# EAGLE design FAL65816_cpu (EAGLE 7.2.0)
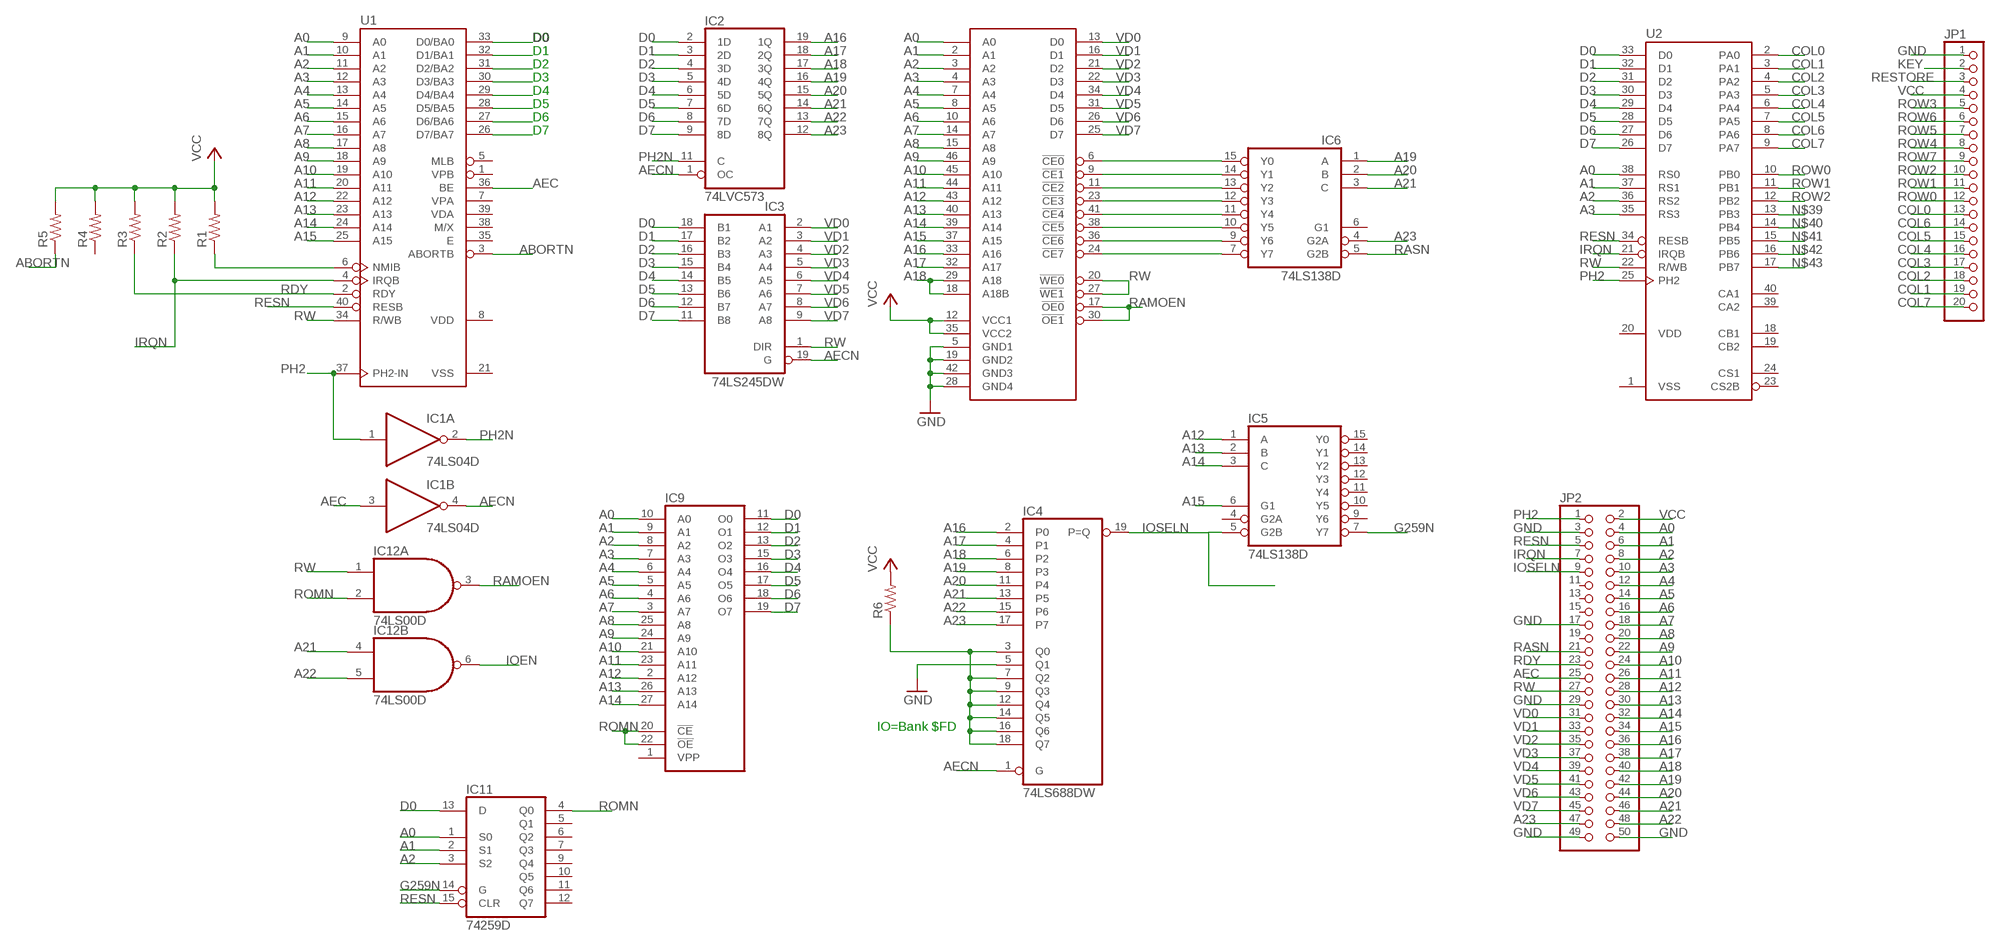
[diagram p0: schematic, sheet 1]

## Parts
IC1  74LS04D  [SO14]
IC2  74LVC573  [SO20W]
IC3  74LS245DW  [SO20W]
IC4  74LS688DW  [SO20W]
IC5  74LS138D  [SO16]
IC6  74LS138D  [SO16]
IC9  27256  [DIL28]
IC11  74259D  [SO16]
IC12  74LS00D  [SO14]
JP1  PINHD-1X20  [1X20]
JP2  PINHD-2X25  [2X25]
R1  R-US_0207/10  [0207/10]
R2  R-US_0207/10  [0207/10]
R3  R-US_0207/10  [0207/10]
R4  R-US_0207/10  [0207/10]
R5  R-US_0207/10  [0207/10]
R6  R-US_0204/7  [0204/7]
U1  W65C816SP  [DIP-40]
U2  G65SC22P  [DIP-40]
U$2  WM-1RAM  [DIL46-1]

## Nets
A0: IC9.10(A0) IC11.1(S0) JP2.4 U1.9(A0) U2.38(RS0) U$2.1(A0)
A1: IC9.9(A1) IC11.2(S1) JP2.6 U1.10(A1) U2.37(RS1) U$2.2(A1)
A2: IC9.8(A2) IC11.3(S2) JP2.8 U1.11(A2) U2.36(RS2) U$2.3(A2)
A3: IC9.7(A3) JP2.10 U1.12(A3) U2.35(RS3) U$2.4(A3)
A4: IC9.6(A4) JP2.12 U1.13(A4) U$2.7(A4)
A5: IC9.5(A5) JP2.14 U1.14(A5) U$2.8(A5)
A6: IC9.4(A6) JP2.16 U1.15(A6) U$2.10(A6)
A7: IC9.3(A7) JP2.18 U1.16(A7) U$2.14(A7)
A8: IC9.25(A8) JP2.20 U1.17(A8) U$2.15(A8)
A9: IC9.24(A9) JP2.22 U1.18(A9) U$2.46(A9)
A10: IC9.21(A10) JP2.24 U1.19(A10) U$2.45(A10)
A11: IC9.23(A11) JP2.26 U1.20(A11) U$2.44(A11)
A12: IC5.1(A) IC9.2(A12) JP2.28 U1.22(A12) U$2.43(A12)
A13: IC5.2(B) IC9.26(A13) JP2.30 U1.23(A13) U$2.40(A13)
A14: IC5.3(C) IC9.27(A14) JP2.32 U1.24(A14) U$2.39(A14)
A15: IC5.6(G1) JP2.34 U1.25(A15) U$2.37(A15)
A16: IC2.19(1Q) IC4.2(P0) JP2.36 U$2.33(A16)
A17: IC2.18(2Q) IC4.4(P1) JP2.38 U$2.32(A17)
A18: IC2.17(3Q) IC4.6(P2) JP2.40 U$2.18(A18B) U$2.29(A18)
A19: IC2.16(4Q) IC4.8(P3) IC6.1(A) JP2.42
A20: IC2.15(5Q) IC4.11(P4) IC6.2(B) JP2.44
A21: IC2.14(6Q) IC4.13(P5) IC6.3(C) IC12.4(B:I0) JP2.46
A22: IC2.13(7Q) IC4.15(P6) IC12.5(B:I1) JP2.48
A23: IC2.12(8Q) IC4.17(P7) IC6.4(G2A) JP2.47
ABORTN: R5.1 U1.3(ABORTB)
AEC: IC1.3(B:I) JP2.25 U1.36(BE)
AECN: IC1.4(B:O) IC2.1(OC) IC3.19(G) IC4.1(G)
COL0: JP1.13 U2.2(PA0)
COL1: JP1.19 U2.3(PA1)
COL2: JP1.18 U2.4(PA2)
COL3: JP1.17 U2.5(PA3)
COL4: JP1.16 U2.6(PA4)
COL5: JP1.15 U2.7(PA5)
COL6: JP1.14 U2.8(PA6)
COL7: JP1.20 U2.9(PA7)
D0: IC2.2(1D) IC3.18(B1) IC9.11(O0) IC11.13(D) U1.33(D0/BA0) U2.33(D0)
D1: IC2.3(2D) IC3.17(B2) IC9.12(O1) U1.32(D1/BA1) U2.32(D1)
D2: IC2.4(3D) IC3.16(B3) IC9.13(O2) U1.31(D2/BA2) U2.31(D2)
D3: IC2.5(4D) IC3.15(B4) IC9.15(O3) U1.30(D3/BA3) U2.30(D3)
D4: IC2.6(5D) IC3.14(B5) IC9.16(O4) U1.29(D4/BA4) U2.29(D4)
D5: IC2.7(6D) IC3.13(B6) IC9.17(O5) U1.28(D5/BA5) U2.28(D5)
D6: IC2.8(7D) IC3.12(B7) IC9.18(O6) U1.27(D6/BA6) U2.27(D6)
D7: IC2.9(8D) IC3.11(B8) IC9.19(O7) U1.26(D7/BA7) U2.26(D7)
G259N: IC5.7(Y7) IC11.14(G)
GND: IC4.5(Q1) JP1.1 JP2.3 JP2.17 JP2.29 JP2.49 JP2.50 U$2.5(GND1) U$2.19(GND2) U$2.28(GND4) U$2.42(GND3)
IOEN: IC12.6(B:O)
IOSELN: IC4.19(P=Q) IC5.5(G2B) JP2.9
IRQN: JP2.7 R2.1 U1.4(IRQB) U2.21(IRQB)
KEY: JP1.2
N$1: R1.1 U1.6(NMIB)
N$4: IC6.15(Y0) U$2.6(!CE0)
N$5: IC6.14(Y1) U$2.9(!CE1)
N$6: IC6.13(Y2) U$2.11(!CE2)
N$7: IC6.12(Y3) U$2.23(!CE3)
N$8: IC6.11(Y4) U$2.41(!CE4)
N$9: IC6.10(Y5) U$2.38(!CE5)
N$10: IC6.9(Y6) U$2.36(!CE6)
N$11: IC6.7(Y7) U$2.24(!CE7)
N$12: IC4.3(Q0) IC4.7(Q2) IC4.9(Q3) IC4.12(Q4) IC4.14(Q5) IC4.16(Q6) IC4.18(Q7) R6.1
N$39: U2.13(PB3)
N$40: U2.14(PB4)
N$41: U2.15(PB5)
N$42: U2.16(PB6)
N$43: U2.17(PB7)
PH2: IC1.1(A:I) JP2.1 U1.37(PH2-IN) U2.25(PH2)
PH2N: IC1.2(A:O) IC2.11(C)
RAMOEN: IC12.3(A:O) U$2.17(!OE0) U$2.30(!OE1)
RASN: IC6.5(G2B) JP2.21
RDY: JP2.23 R3.1 U1.2(RDY)
RESN: IC11.15(CLR) JP2.5 U1.40(RESB) U2.34(RESB)
RESTORE: JP1.3
ROMN: IC9.20(!CE) IC9.22(!OE) IC11.4(Q0) IC12.2(A:I1)
ROW0: JP1.12 U2.10(PB0)
ROW1: JP1.11 U2.11(PB1)
ROW2: JP1.10 U2.12(PB2)
ROW3: JP1.5
ROW4: JP1.8
ROW5: JP1.7
ROW6: JP1.6
ROW7: JP1.9
RW: IC3.1(DIR) IC12.1(A:I0) JP2.27 U1.34(R/WB) U2.22(R/WB) U$2.20(!WE0) U$2.27(!WE1)
VCC: JP1.4 JP2.2 R1.2 R2.2 R3.2 R4.2 R5.2 R6.2 U$2.12(VCC1) U$2.35(VCC2)
VD0: IC3.2(A1) JP2.31 U$2.13(D0)
VD1: IC3.3(A2) JP2.33 U$2.16(D1)
VD2: IC3.4(A3) JP2.35 U$2.21(D2)
VD3: IC3.5(A4) JP2.37 U$2.22(D3)
VD4: IC3.6(A5) JP2.39 U$2.34(D4)
VD5: IC3.7(A6) JP2.41 U$2.31(D5)
VD6: IC3.8(A7) JP2.43 U$2.26(D6)
VD7: IC3.9(A8) JP2.45 U$2.25(D7)
Unconnected: IC1.5(C:I) IC1.6(C:O) IC1.8(D:O) IC1.9(D:I) IC1.10(E:O) IC1.11(E:I) IC1.12(F:O) IC1.13(F:I) IC5.4(G2A) IC5.9(Y6) IC5.10(Y5) IC5.11(Y4) IC5.12(Y3) IC5.13(Y2) IC5.14(Y1) IC5.15(Y0) IC6.6(G1) IC9.1(VPP) IC11.5(Q1) IC11.6(Q2) IC11.7(Q3) IC11.9(Q4) IC11.10(Q5) IC11.11(Q6) IC11.12(Q7) IC12.8(C:O) IC12.9(C:I0) IC12.10(C:I1) IC12.11(D:O) IC12.12(D:I0) IC12.13(D:I1) JP2.11 JP2.13 JP2.15 JP2.19 R4.1 U1.1(VPB) U1.5(MLB) U1.7(VPA) U1.21(VSS) U1.35(E) U1.38(M/X) U1.39(VDA) U2.1(VSS) U2.18(CB1) U2.19(CB2) U2.23(CS2B) U2.24(CS1) U2.39(CA2) U2.40(CA1)

## Notes on the sheet
- IO=Bank $FD

## Power pins joined to a net without a drawn wire
GND: IC1.7(P:GND) IC2.10(GND) IC3.10(GND) IC4.10(GND) IC5.8(GND) IC6.8(GND) IC9.14(GND) IC11.8(GND) IC12.7(P:GND)
VCC: IC1.14(P:VCC) IC2.20(VCC) IC3.20(VCC) IC4.20(VCC) IC5.16(VCC) IC6.16(VCC) IC9.28(VCC) IC11.16(VCC) IC12.14(P:VCC)
VDD: U1.8(VDD) U2.20(VDD)

## Library data of the parts
IC1 = 74xx-us:74*04: Hex INVERTER
IC2 = FT74xx:74*573: 8-bit D latch BUS DRIVER
IC3 = FT74xx:74*245: Octal BUS TRANSCEIVER, 3-state
IC4 = FT74xx:74*688: 8-bit MAGNITUDE/IDENTITY COMPARATOR, totem pole
IC5 IC6 = FT74xx:74*138: 3-line to 8-line DECODER/DEMULTIPLEXER
IC9 = memory:27256: MEMORY
IC11 = 74xx-us:74*259: 8-bit addressable LATCH
IC12 = 74xx-us:74*00: Quad 2-input NAND gate
JP1 = pinhead:PINHD-1X20: PIN HEADER
JP2 = pinhead:PINHD-2X25: PIN HEADER
R1-R6 = resistor:R-US_: RESISTOR, American symbol
U1 = 65xxx:W65C816SP: Wetern Digital Version
U2 = 65xxx:G65SC22P: California Micro Devices Version
U$2 = FT74xx:WM-1RAM: Wilson Mines RAM Module

## Board
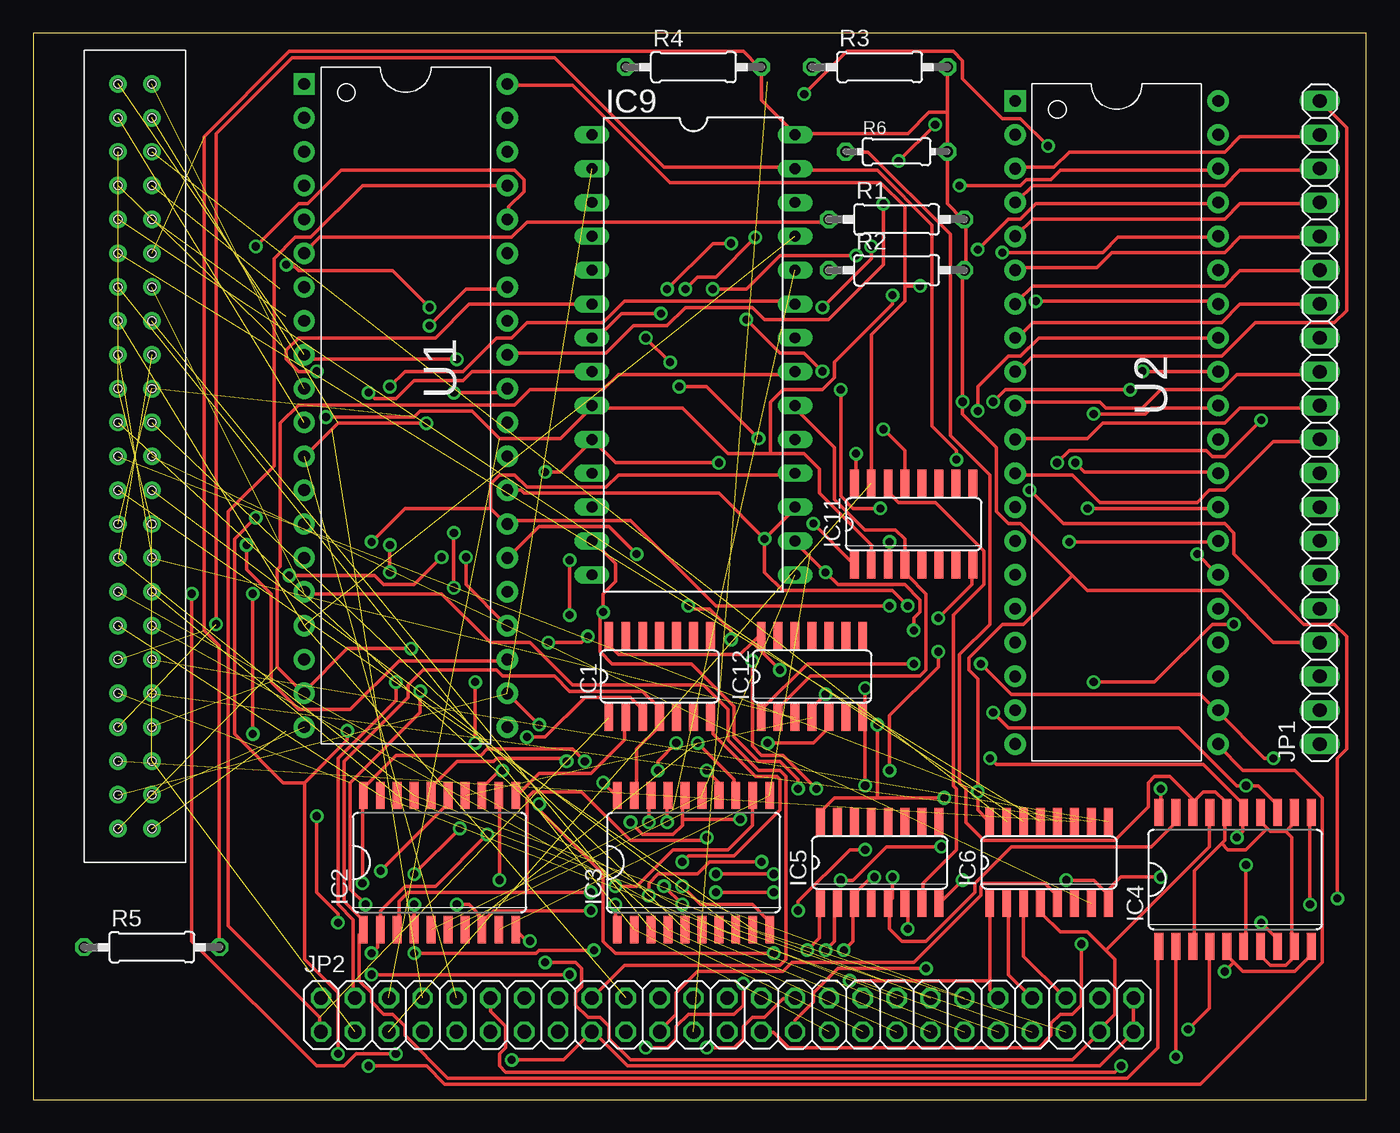
[diagram p1: board, top side]
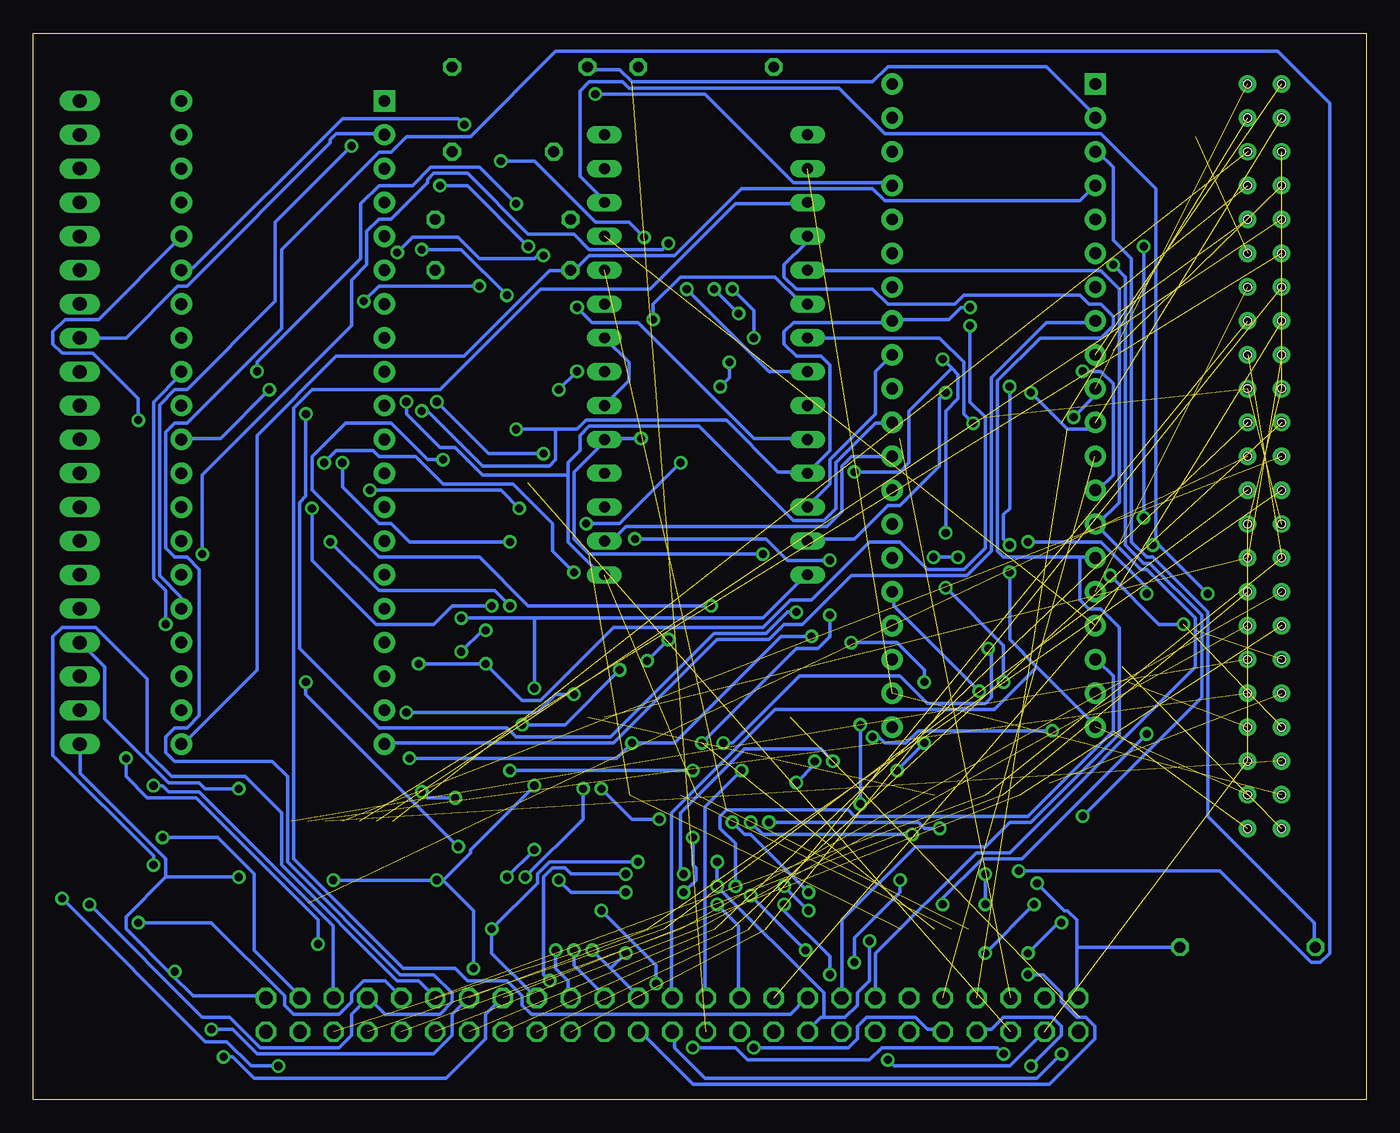
[diagram p2: board, bottom side, seen from below]

Size 100 x 80 mm. Coordinates in mm from the lower left corner, seen from the top.
Outline: 0,0 100,0 100,80 0,80 0,0
Copper layers (1*16): Top 0.035mm / dielectric 1.5mm / Bottom 0.035mm
Design rules "default": minimum track width 10mil, minimum drill 24mil, track to track 8mil, track to pad 8mil, pad to pad 8mil, via to via 8mil, smd to smd 8mil, copper to edge 40mil, drill to drill 8mil, minimum pad ring 10mil, minimum via ring 8mil, stop-mask expansion 4mil, vias tented up to drill 0mil, thermal gap 10mil

### Footprints (pad centres in the part's own frame; a part is rotated, then mirrored left to right if it is on the bottom)
SO14 = smd 0.66 x 2.032: 1 -3.81,-3.073; 2 -2.54,-3.073; 3 -1.27,-3.073; 4 0,-3.073; 5 1.27,-3.073; 6 2.54,-3.073; 7 3.81,-3.073; 8 3.81,3.073; 9 2.54,3.073; 10 1.27,3.073; 11 0,3.073; 12 -1.27,3.073; 13 -2.54,3.073; 14 -3.81,3.073
SO20W = smd 0.66 x 2.032: 1 -5.715,-5.029; 2 -4.445,-5.029; 3 -3.175,-5.029; 4 -1.905,-5.029; 5 -0.635,-5.029; 6 0.635,-5.029; 7 1.905,-5.029; 8 3.175,-5.029; 9 4.445,-5.029; 10 5.715,-5.029; 11 5.715,5.029; 12 4.445,5.029; 13 3.175,5.029; 14 1.905,5.029; 15 0.635,5.029; 16 -0.635,5.029; 17 -1.905,5.029; 18 -3.175,5.029; 19 -4.445,5.029; 20 -5.715,5.029
SO16 = smd 0.66 x 2.032: 1 -4.445,-3.073; 2 -3.175,-3.073; 3 -1.905,-3.073; 4 -0.635,-3.073; 5 0.635,-3.073; 6 1.905,-3.073; 7 3.175,-3.073; 8 4.445,-3.073; 9 4.445,3.073; 10 3.175,3.073; 11 1.905,3.073; 12 0.635,3.073; 13 -0.635,3.073; 14 -1.905,3.073; 15 -3.175,3.073; 16 -4.445,3.073
DIL28 = drill 0.813 long: 1 -16.51,-7.62; 2 -13.97,-7.62; 3 -11.43,-7.62; 4 -8.89,-7.62; 5 -6.35,-7.62; 6 -3.81,-7.62; 7 -1.27,-7.62; 8 1.27,-7.62; 9 3.81,-7.62; 10 6.35,-7.62; 11 8.89,-7.62; 12 11.43,-7.62; 13 13.97,-7.62; 14 16.51,-7.62; 15 16.51,7.62; 16 13.97,7.62; 17 11.43,7.62; 18 8.89,7.62; 19 6.35,7.62; 20 3.81,7.62; 21 1.27,7.62; 22 -1.27,7.62; 23 -3.81,7.62; 24 -6.35,7.62; 25 -8.89,7.62; 26 -11.43,7.62; 27 -13.97,7.62; 28 -16.51,7.62
1X20 = drill 1.016 long: 1 -24.13,0; 2 -21.59,0; 3 -19.05,0; 4 -16.51,0; 5 -13.97,0; 6 -11.43,0; 7 -8.89,0; 8 -6.35,0; 9 -3.81,0; 10 -1.27,0; 11 1.27,0; 12 3.81,0; 13 6.35,0; 14 8.89,0; 15 11.43,0; 16 13.97,0; 17 16.51,0; 18 19.05,0; 19 21.59,0; 20 24.13,0
2X25 = drill 1.016 octagon: 1 -30.48,-1.27; 2 -30.48,1.27; 3 -27.94,-1.27; 4 -27.94,1.27; 5 -25.4,-1.27; 6 -25.4,1.27; 7 -22.86,-1.27; 8 -22.86,1.27; 9 -20.32,-1.27; 10 -20.32,1.27; 11 -17.78,-1.27; 12 -17.78,1.27; 13 -15.24,-1.27; 14 -15.24,1.27; 15 -12.7,-1.27; 16 -12.7,1.27; 17 -10.16,-1.27; 18 -10.16,1.27; 19 -7.62,-1.27; 20 -7.62,1.27; 21 -5.08,-1.27; 22 -5.08,1.27; 23 -2.54,-1.27; 24 -2.54,1.27; 25 0,-1.27; 26 0,1.27; 27 2.54,-1.27; 28 2.54,1.27; 29 5.08,-1.27; 30 5.08,1.27; 31 7.62,-1.27; 32 7.62,1.27; 33 10.16,-1.27; 34 10.16,1.27; 35 12.7,-1.27; 36 12.7,1.27; 37 15.24,-1.27; 38 15.24,1.27; 39 17.78,-1.27; 40 17.78,1.27; 41 20.32,-1.27; 42 20.32,1.27; 43 22.86,-1.27; 44 22.86,1.27; 45 25.4,-1.27; 46 25.4,1.27; 47 27.94,-1.27; 48 27.94,1.27; 49 30.48,-1.27; 50 30.48,1.27
0207/10 = drill 0.813 octagon: 1 -5.08,0; 2 5.08,0
0204/7 = drill 0.813 octagon: 1 -3.81,0; 2 3.81,0
DIP-40 = drill 0.889 pad 1.6 square: 1 -22.86,-7.62 | drill 0.889 pad 1.6: 2 -20.32,-7.62; 3 -17.78,-7.62; 4 -15.24,-7.62; 5 -12.7,-7.62; 6 -10.16,-7.62; 7 -7.62,-7.62; 8 -5.08,-7.62; 9 -2.54,-7.62; 10 0,-7.62; 11 2.54,-7.62; 12 5.08,-7.62; 13 7.62,-7.62; 14 10.16,-7.62; 15 12.7,-7.62; 16 15.24,-7.62; 17 17.78,-7.62; 18 20.32,-7.62; 19 22.86,-7.62; 20 25.4,-7.62; 21 25.4,7.62; 22 22.86,7.62; 23 20.32,7.62; 24 17.78,7.62; 25 15.24,7.62; 26 12.7,7.62; 27 10.16,7.62; 28 7.62,7.62; 29 5.08,7.62; 30 2.54,7.62; 31 0,7.62; 32 -2.54,7.62; 33 -5.08,7.62; 34 -7.62,7.62; 35 -10.16,7.62; 36 -12.7,7.62; 37 -15.24,7.62; 38 -17.78,7.62; 39 -20.32,7.62; 40 -22.86,7.62
DIL46-1 = drill 0.8: 1 -15.24,7.62; 2 -12.7,7.62; 3 -15.24,5.08; 4 -12.7,5.08; 5 -15.24,2.54; 6 -12.7,2.54; 7 -15.24,0; 8 -12.7,0; 9 -15.24,-2.54; 10 -12.7,-2.54; 11 -15.24,-5.08; 12 -12.7,-5.08; 13 -15.24,-7.62; 14 -12.7,-7.62; 15 -15.24,-10.16; 16 -12.7,-10.16; 17 -15.24,-12.7; 18 -12.7,-12.7; 19 -15.24,-15.24; 20 -12.7,-15.24; 21 -15.24,-17.78; 22 -12.7,-17.78; 23 -15.24,-20.32; 24 -12.7,-20.32; 25 -15.24,-22.86; 26 -12.7,-22.86; 27 -15.24,-25.4; 28 -12.7,-25.4; 29 -15.24,-27.94; 30 -12.7,-27.94; 31 -15.24,-30.48; 32 -12.7,-30.48; 33 -15.24,-33.02; 34 -12.7,-33.02; 35 -15.24,-35.56; 36 -12.7,-35.56; 37 -15.24,-38.1; 38 -12.7,-38.1; 39 -15.24,-40.64; 40 -12.7,-40.64; 41 -15.24,-43.18; 42 -12.7,-43.18; 43 -15.24,-45.72; 44 -12.7,-45.72; 45 -15.24,-48.26; 46 -12.7,-48.26 | hole 0.6: -15.24,7.62; -15.24,5.08; -15.24,2.54; -15.24,0; -15.24,-2.54; -15.24,-5.08; -15.24,-7.62; -15.24,-10.16; -15.24,-12.7; -15.24,-15.24; -15.24,-17.78; -15.24,-20.32; -15.24,-22.86; -15.24,-25.4; -15.24,-27.94; -15.24,-30.48; -15.24,-33.02; -15.24,-35.56; -15.24,-38.1; -15.24,-40.64; -15.24,-43.18; -15.24,-45.72; -15.24,-48.26; -12.7,7.62; -12.7,5.08; -12.7,2.54; -12.7,0; -12.7,-2.54; -12.7,-5.08; -12.7,-7.62; -12.7,-10.16; -12.7,-12.7; -12.7,-15.24; -12.7,-17.78; -12.7,-20.32; -12.7,-22.86; -12.7,-25.4; -12.7,-27.94; -12.7,-30.48; -12.7,-33.02; -12.7,-35.56; -12.7,-38.1; -12.7,-40.64; -12.7,-43.18; -12.7,-45.72; -12.7,-48.26

### Placement (x,y rotation side)
IC1  46.99,31.75 0 top
IC2  30.48,17.78 0 top
IC3  49.53,17.78 0 top
IC4  90.17,16.51 0 top
IC5  63.5,17.78 0 top
IC6  76.2,17.78 0 top
IC9  49.53,55.88 270 top
IC11  66.04,43.18 0 top
IC12  58.42,31.75 0 top
JP1  96.52,50.8 90 top
JP2  52.07,6.35 0 top
R1  64.77,66.04 0 top
R2  64.77,62.23 0 top
R3  63.5,77.47 0 top
R4  49.53,77.47 0 top
R5  8.89,11.43 0 top
R6  64.77,71.12 0 top
U1  27.94,53.34 270 top
U2  81.28,52.07 270 top
U$2  21.59,68.58 0 top

### Tracks (layer width: path | path; a pad name or v marks a point on that pad's centre or on a via)
A0  (via drill 0.61)  (1 unrouted)
  Top 0.254: v27.2,31.32 27.2,29.95 22.86,25.6 22.86,14.63 24,13.49 24,7.77 JP2.4 | v31.55,42.52 v31.55,38.41 | v31.77,55.55 20.57,55.55 20.34,55.78 U1.9 | v58.52,43.2 61.49,40.23 IC11.1 | v51.44,47.78 43.66,47.78 IC9.10 41.83,49.38 39.55,47.09 v38.41,47.09 | v69.49,68.58 74.07,68.58 74.52,69.04 76.35,69.04 77.04,69.72 88.7,69.72 U2.38 | v62.87,64.01 62.87,63.09 v59.21,59.44
  Bottom 0.254: v27.2,31.32 27.2,34.06 v31.55,38.41 | v31.55,42.52 31.55,51.66 30.63,52.58 30.63,54.41 31.09,54.86 | v31.77,55.55 31.09,54.86 | v58.52,43.2 56.01,43.2 v51.44,47.78 | v69.49,68.58 67.44,68.58 v62.87,64.01 | v59.21,59.44 58.06,58.29 54.63,58.29 45.95,49.61 42.06,49.61 IC9.10 | 31.09,54.86 34.29,51.66 34.29,47.78 34.98,47.09 v38.41,47.09
A1  (via drill 0.61)  (2 unrouted)
  Top 0.254: IC11.2 62.87,41.6 58.98,45.49 58.98,47.32 57.84,48.46 55.32,48.46 | 55.32,48.46 52.12,48.46 48.69,51.89 42.06,51.89 IC9.9 41.83,51.89 39.55,49.61 34.98,49.61 32.92,51.66 29.03,51.66 28.57,51.21 v21.95,51.21 | v70.87,63.78 73.15,66.06 74.07,66.06 75.21,67.21 88.7,67.21 U2.37 | v64.47,60.35 64.47,59.66 60.12,55.32 60.12,54.18 59.21,53.26 56.24,53.26 55.32,52.35 55.32,48.46
  Bottom 0.254: v21.95,51.21 20.34,52.81 20.34,53.26 U1.10 | v70.87,63.78 67.89,63.78 v64.47,60.35
A2  (via drill 0.61)  (2 unrouted)
  Top 0.254: v25.15,53.03 25.6,52.58 27.2,52.58 28.57,53.95 32.23,53.95 32.92,54.63 41.83,54.63 IC9.8 | v64.24,41.83 64.24,40.23 IC11.3 | v76.81,47.78 77.72,48.69 88.01,48.69 88.47,48.23 89.38,48.23 v92.13,50.98 | v50.98,60.81 53.49,60.81 56.01,63.32 v61.72,63.32 | v72.69,63.55 80.24,63.55 81.38,64.69 88.7,64.69 U2.36
  Bottom 0.254: v25.15,53.03 22.4,50.29 20.8,50.29 20.34,50.75 U1.11 | v64.24,41.83 71.78,41.83 73.15,43.2 74.07,43.2 76.81,45.95 v76.81,47.78 | v92.13,50.98 92.13,52.58 95.56,56.01 97.84,56.01 98.53,56.69 98.53,57.61 97.61,58.52 95.1,58.52 88.92,64.69 U2.36 | v50.98,60.81 44.81,54.63 42.06,54.63 IC9.8 | v61.72,63.32 62.18,63.32 62.41,63.09 66.52,63.09 68.12,64.69 71.55,64.69 v72.69,63.55
A3  (via drill 0.61)  (2 unrouted)
  Top 0.254: v29.49,50.75 22.86,50.75 20.34,48.23 U1.12 | v64.92,70.41 v67.67,73.15 | v54.18,64.69 51.21,61.72 49.84,61.72 v48.92,60.81 | v47.09,58.98 44.12,58.98 42.29,57.15 IC9.7
  Bottom 0.254: IC9.7 32,57.15 30.18,55.32 30.18,51.44 v29.49,50.75 | v67.67,73.15 68.12,73.61 76.81,73.61 88.01,62.41 88.7,62.41 U2.35 | v64.92,70.41 62.41,70.41 57.84,65.84 55.32,65.84 v54.18,64.69 | v47.09,58.98 v48.92,60.81
A4  (via drill 0.61)  (1 unrouted)
  Top 0.254: v21.26,54.63 19.89,54.63 18.97,55.55 18.97,56.24 19.89,57.15 30.18,57.15 32.69,59.66 41.83,59.66 IC9.6 | JP2.12 34.29,6.63 35.43,5.49 35.43,3.89 34.98,3.43 34.98,2.52 35.43,2.06 81.15,2.06 v81.61,2.52 | v97.84,15.09 97.84,25.6 98.53,26.29 98.53,34.75 97.61,35.66 95.33,35.66 90.07,40.92 90.07,42.52 89.38,43.2 77.27,43.2 v74.75,45.72 | v63.55,44.35 61.49,44.35 60.58,45.26 v60.58,53.26 | v59.21,54.63 57.84,56.01 56.01,56.01 v53.49,58.52
  Bottom 0.254: v21.26,54.63 19.89,54.63 18.97,53.72 18.97,46.86 20.12,45.72 U1.13 | v81.61,2.52 83.67,2.52 85.5,4.34 87.1,4.34 v97.84,15.09 | v74.75,45.72 64.92,45.72 v63.55,44.35 | v59.21,54.63 v60.58,53.26 | v53.49,58.52 53.49,59.66 51.44,61.72 44.35,61.72 42.52,59.89 42.06,59.89 IC9.6
A5  (1 unrouted)
  Bottom 0.254: IC9.5 41.83,62.18 19.89,62.18 18.52,60.81 18.52,44.81 20.12,43.2 U1.14 16.92,39.78 16.46,39.78 12.8,36.12 12.8,32.46 26.75,18.52 29.26,18.52 36.8,10.97 36.8,7.77 JP2.14
A6  (1 unrouted)
  Bottom 0.254: 21.49,40.69 20.34,40.69 U1.15 | 21.49,40.69 27.2,40.69 27.66,41.15 27.66,53.95 24.46,57.15 19.89,57.15 18.97,58.06 18.97,58.75 19.89,59.66 20.8,59.66 21.49,60.35 30.18,60.35 30.86,59.66 35.89,59.66 37.03,60.81 42.75,60.81 43.66,61.72 43.66,62.64 42.06,64.24 42.06,64.69 IC9.4 | 21.49,40.69 21.49,37.49 20.8,36.8 19.89,36.8 18.52,35.43 18.52,27.43 25.15,20.8 26.75,20.8 28.57,18.97 33.83,18.97 39.32,13.49 39.32,7.77 JP2.16
A7  (1 unrouted)
  Top 0.254: JP2.18 44.35,10.06 56.01,10.06 56.46,10.52 56.46,24.23 56.01,24.69 54.41,24.69 52.12,26.98 52.12,29.26 50.29,31.09 40.46,31.09 37.26,34.29 34.29,34.29 30.63,37.95 20.34,37.95 U1.16
  Bottom 0.254: IC9.3 42.06,67.21 47.32,67.21 53.72,60.81 61.95,60.81 69.49,53.26 79.1,53.26 80.47,51.89 80.47,18.06 72.24,9.83 68.35,9.83 67.44,8.91 64.47,8.91 63.32,7.77 63.32,7.09 62.64,6.4 43.2,6.4 42.06,7.54 JP2.18
A8  (3 unrouted)
A9  (via drill 0.61)  (2 unrouted)
  Top 0.254: v47.32,16 v48.69,14.63
  Bottom 0.254: v48.69,14.63 47.09,13.03 47.09,7.77 JP2.22 | v47.32,16 47.32,19.2 48.46,20.34 48.46,21.26 48.01,21.72 38.86,21.72 38.41,21.26 25.38,21.26 18.97,27.66 18.97,31.77 20.12,32.92 U1.18
A10  (via drill 0.61)  (1 unrouted)
  Top 0.254: IC9.21 57.15,54.41 43.89,54.41 42.75,53.26 37.26,53.26 36.12,52.12 19.89,52.12 18.52,50.75 18.52,40.01 18.29,39.78 18.29,32.46 20.12,30.63 U1.19 20.34,30.63 23.55,33.83 v28.35,33.83 | v46.86,24.69 46.86,25.38 v48.23,26.75
  Bottom 0.254: v46.86,24.69 49.61,21.95 49.61,7.77 JP2.24 | v48.23,26.75 47.55,26.75 42.52,31.77 34.98,31.77 32.92,29.72 28.57,29.72 28.12,30.18 28.12,33.6 v28.35,33.83
A11  (via drill 0.61)  (1 unrouted)
  Top 0.254: v26.75,53.49 27.89,54.63 32.23,54.63 34.75,57.15 35.89,57.15 37.03,58.29 42.75,58.29 44.35,59.89 57.15,59.89 IC9.23 | v26.75,39.55 v26.75,41.6
  Bottom 0.254: v26.75,53.49 26.75,44.35 27.2,43.89 27.2,42.06 v26.75,41.6 | v26.75,39.55 26.75,34.52 24.69,32.46 | 24.69,32.46 20.34,28.12 U1.20 | 24.69,32.46 27.89,29.26 44.35,29.26 52.12,21.49 52.12,7.77 JP2.26
A12  (via drill 0.61)  (2 unrouted)
  Top 0.254: v58.06,11.2 58.98,12.12 58.98,14.63 IC5.1 | v37.95,28.12 35.66,30.4 U1.22 | v37.95,22.17 37.95,21.72 42.75,16.92 42.75,11.89 43.66,10.97 v55.55,10.97
  Bottom 0.254: 56.69,9.83 54.63,7.77 JP2.28 | 56.69,9.83 v58.06,11.2 | v37.95,22.17 v37.95,28.12 | 56.69,9.83 v55.55,10.97
A13  (via drill 0.61)  (1 unrouted)
  Top 0.254: v59.44,11.2 60.12,11.89 60.12,14.63 IC5.2 | v16,41.6 16,39.78 17.83,37.95 17.83,31.32 19.89,29.26 23.77,29.26 27.43,32.92 35.43,32.92 U1.23 | v50.52,3.89 52.58,3.89 53.26,4.57 53.26,5.49 53.95,6.17 54.86,6.17 56.24,7.54 57.15,7.54 JP2.30 | v27.2,3.43 24.23,3.43 23.32,2.52 21.26,2.52 11.89,11.89 v11.89,37.95
  Bottom 0.254: v59.44,11.2 59.44,10.06 57.15,7.77 JP2.30 | 15.77,41.83 15.77,68.35 19.89,72.47 36.12,72.47 39.55,75.89 55.32,75.89 55.78,76.35 58.29,76.35 58.98,75.67 58.98,69.27 57.15,67.44 IC9.26 | v50.52,3.89 47.32,3.89 46.41,2.97 37.26,2.97 36.35,3.89 27.66,3.89 v27.2,3.43 | 15.77,41.83 v11.89,37.95 | 15.77,41.83 v16,41.6
A14  (via drill 0.61)  (1 unrouted)
  Top 0.254: v60.81,11.2 61.49,11.89 61.49,14.63 IC5.3 61.72,14.86 61.72,15.54 62.87,16.69 v63.09,16.69 | v13.72,35.66 13.72,72.47 19.43,78.18 39.09,78.18 47.32,69.95 57.15,69.95 IC9.27 57.15,69.72 63.32,69.72 67.44,65.61 67.44,50.52 69.27,48.69 v69.27,48.01 | v19.2,39.32 25.6,39.32 26.29,38.63 28.57,38.63 v30.63,40.69 | v32.46,40.69 32.46,38.63 35.43,35.66 U1.24 | v58.75,23.32 56.24,25.83 54.63,25.83 53.95,26.52 v53.95,32.92 | v52.35,34.52 52.35,35.2 50.75,36.8 49.38,36.8 v49.15,37.03
  Bottom 0.254: v60.81,11.2 60.81,9.83 59.89,8.91 59.89,7.77 JP2.32 | v13.72,35.66 15.54,35.66 v19.2,39.32 | v32.46,40.69 v30.63,40.69 | v63.09,16.69 58.75,21.03 v58.75,23.32 | v52.35,34.52 v53.95,32.92 | v49.15,37.03 62.87,37.03 66.52,40.69 74.07,40.69 79.1,45.72 79.1,48.23 76.58,50.75 73.15,50.75 70.41,48.01 v69.27,48.01
A15  (via drill 0.61)  (1 unrouted)
  Top 0.254: v65.61,12.8 65.61,14.63 IC5.6 | v29.03,30.63 29.03,29.03 23.77,23.77 23.77,15.77 v24.92,14.63 | v28.57,10.97 37.72,10.97 37.95,11.2 v42.06,11.2 | v46.18,15.32 46.18,16.23 46.86,16.92 49.84,16.92 50.75,17.83 v54.63,17.83
  Bottom 0.254: JP2.34 62.41,7.77 65.61,10.97 v65.61,12.8 62.18,16.23 62.18,16.92 61.27,17.83 v54.63,17.83 | v29.03,30.63 35.43,37.03 35.43,37.95 U1.25 | v28.57,10.97 v24.92,14.63 | v46.18,15.32 v42.06,11.2
A16  (via drill 0.61)  (2 unrouted)
  Top 0.254: v85.72,3.2 IC4.2
  Bottom 0.254: v85.72,3.2 85.04,3.2 83.44,1.6 69.04,1.6 66.06,4.57 66.06,6.4 64.92,7.54 JP2.36
A17  (via drill 0.61)  (2 unrouted)
  Top 0.254: v86.64,5.26 88.24,6.86 88.24,11.43 IC4.4
  Bottom 0.254: v86.64,5.26 85.04,5.26 83.21,3.43 69.95,3.43 68.58,4.8 68.58,6.4 67.44,7.54 JP2.38
A18  (via drill 0.61)  (3 unrouted)
  Top 0.254: v90.98,17.6 90.98,11.66 IC4.6
  Bottom 0.254: v90.98,17.6 90.98,18.29 98.53,25.83 98.53,34.75 97.84,35.43 95.33,35.43 91.44,31.55 91.44,26.06 89.61,24.23 84.12,24.23 81.38,21.49 81.38,17.6 72.69,8.91 71.09,8.91 69.95,7.77 JP2.40
A19  (via drill 0.61)
  Top 0.254: 71.78,8.91 71.78,8.23 JP2.42 | 71.78,8.91 71.78,14.63 IC6.1 | v40.01,25.38 39.78,25.6 34.75,25.6 34.52,25.38 31.77,25.38 29.95,23.55 29.95,22.86 IC2.16 | v55.55,16.92 v51.21,16.92 | 71.78,8.91 v61.27,8.91 | v92.13,13.26 93.27,12.12 93.27,11.66 IC4.8
  Bottom 0.254: v40.01,25.38 40.92,26.29 46.63,26.29 51.44,21.49 51.44,17.14 v51.21,16.92 | v55.55,16.92 59.66,16.92 60.12,17.37 61.04,17.37 61.72,16.69 61.72,9.37 v61.27,8.91 | v92.13,13.26 86.64,13.26 81.15,7.77 81.15,7.09 80.47,6.4 77.04,6.4 76.12,7.32 76.12,8 75.21,8.91 73.61,8.91 72.47,7.77 JP2.42
A20  (via drill 0.61)
  Top 0.254: IC6.2 73.15,14.63 73.15,9.37 74.75,7.77 JP2.44 | v95.78,14.63 95.78,21.49 IC4.11 | v26.06,17.14 31.09,22.17 31.09,22.63 IC2.15
  Bottom 0.254: v95.78,14.63 87.33,6.17 85.27,6.17 82.98,3.89 77.04,3.89 76.12,4.8 76.12,6.4 74.98,7.54 JP2.44 74.75,7.54 73.61,6.4 69.49,6.4 68.58,7.32 68.58,8 69.95,9.37 72.47,9.37 80.92,17.83 80.92,24.23 82.07,25.38 89.38,25.38 90.07,26.06 90.07,27.2 89.38,27.89 88.47,27.89 87.55,28.8 87.55,39.78 88.47,40.69 89.38,40.69 90.07,41.38 90.07,50.06 89.38,50.75 88.47,50.75 81.38,57.84 81.38,63.78 74.07,71.09 73.15,71.09 72.01,72.24 67.21,72.24 60.81,78.64 6.63,78.64 2.74,74.75 2.74,10.97 3.43,10.29 4.12,10.29 10.97,17.14 v26.06,17.14
A21  (via drill 0.61)  (1 unrouted)
  Top 0.254: IC6.3 74.3,10.74 77.27,7.77 JP2.46 | IC4.13 93.27,21.72 93.27,22.17 91.9,23.55 v90.98,23.55 90.3,23.55 85.95,27.89 73.15,27.89 v72.01,29.03 | v59.44,30.4 58.52,29.49 58.52,28.8 IC12.4
  Bottom 0.254: v90.98,23.55 90.3,23.55 89.84,23.09 87.55,23.09 77.5,13.03 77.5,7.77 JP2.46 | v59.44,30.4 60.81,30.4 62.18,29.03 v72.01,29.03
A22  (via drill 0.61)
  Top 0.254: v90.3,19.66 90.75,20.12 90.75,21.49 IC4.15 90.75,21.72 90.75,22.17 87.78,25.15 72.24,25.15 v71.78,25.6 | v35.2,24.69 34.98,24.69 33.83,23.55 33.83,22.86 IC2.13 | v33.15,31.32 v33.15,26.75 | v38.63,34.29 41.15,34.29 v41.6,34.75 | v55.09,26.75 58.52,26.75 59.66,27.89 59.66,28.57 IC12.5
  Bottom 0.254: v90.3,19.66 86.18,19.66 83.44,16.92 83.44,11.2 80.01,7.77 JP2.48 | v33.15,26.75 v35.2,24.69 | v33.15,31.32 33.15,32.23 35.2,34.29 v38.63,34.29 | v41.6,34.75 43.89,34.75 51.89,26.75 v55.09,26.75 56.24,25.6 v71.78,25.6
A23  (via drill 0.61)
  Top 0.254: v34.98,16.46 34.98,22.63 IC2.12 | v38.41,10.29 40.69,10.29 41.15,9.83 41.15,8.46 40.69,8 40.69,7.09 41.6,6.17 42.52,6.17 43.2,5.49 43.2,4.57 44.81,2.97 77.95,2.97 80.01,5.03 JP2.47 80.01,5.26 81.15,6.4 81.15,10.52 80.47,11.2 | 80.47,11.2 79.1,12.57 77.04,12.57 75.67,13.95 75.67,14.63 IC6.4 | 80.47,11.2 88.24,18.97 88.24,21.49 IC4.17
  Bottom 0.254: v34.98,16.46 34.98,15.54 38.41,12.12 v38.41,10.29
ABORTN
  Bottom 0.254: R5.1 3.89,11.43 3.89,13.26 11.89,21.26 11.89,36.58 16,40.69 16.46,40.69 17.6,41.83 17.6,63.09 18.97,64.47 18.97,69.95 20.12,71.09 U1.3
AEC  (via drill 0.61)
  Top 0.254: IC1.3 45.72,29.26 44.81,30.18 41.38,30.18 38.41,27.2 v37.03,27.2 | v23.55,27.66 23.55,26.98 20.34,23.77 | 20.34,23.77 20.34,10.52 22.86,8 v22.86,3.43 | v16.69,64.01 19.89,67.21 20.57,67.21 23.09,69.72 36.12,69.72 36.8,69.04 36.8,68.12 35.66,66.98 35.66,66.06 U1.36 | v16.69,43.66 15.09,42.06 15.09,27.43 18.75,23.77 20.34,23.77
  Bottom 0.254: v37.03,27.2 36.58,27.2 36.12,26.75 34.52,26.75 33.6,27.66 v23.55,27.66 | v22.86,3.43 24.69,1.6 49.61,1.6 51.89,3.89 51.89,5.03 JP2.25 | v16.69,43.66 v16.69,64.01
AECN
  Top 0.254: IC3.19 45.26,22.86 45.26,26.29 46.86,27.89 46.86,28.57 IC1.4 46.86,28.8 46.86,29.49 45.72,30.63 40.23,30.63 39.09,31.77 35.2,31.77 34.75,32.23 29.26,32.23 28.12,31.09 28.12,30.18 23.32,25.38 23.32,14.86 24.69,13.49 24.69,12.8 IC2.1 24.69,12.57 24.46,12.34 24.46,8.91 25.38,8 25.38,7.32 26.29,6.4 26.98,6.4 27.89,5.49 27.89,4.8 31.09,1.6 82.07,1.6 84.35,3.89 84.35,11.43 IC4.1
COL0
  Bottom 0.254: JP1.13 93.04,57.15 89.15,61.04 88.47,61.04 77.72,71.78 77.72,72.01 77.27,72.47 73.84,72.47 U2.2
COL1
  Top 0.254: JP1.19 96.47,72.24 90.53,72.24 89.38,71.09 77.72,71.09 76.58,69.95 73.84,69.95 U2.3
COL2
  Top 0.254: JP1.18 96.47,69.72 90.53,69.72 89.38,68.58 74.98,68.58 73.84,67.44 U2.4
COL3
  Top 0.254: JP1.17 96.47,67.21 90.53,67.21 89.38,66.06 74.98,66.06 73.84,64.92 U2.5
COL4
  Top 0.254: JP1.16 96.47,64.69 90.53,64.69 89.38,63.55 80.92,63.55 79.78,62.41 73.84,62.41 U2.6
COL5
  Top 0.254: JP1.15 96.47,62.18 90.53,62.18 89.38,61.04 74.98,61.04 73.84,59.89 U2.7
COL6
  Top 0.254: JP1.14 96.47,59.66 90.53,59.66 89.15,58.29 74.98,58.29 73.84,57.15 U2.8
COL7
  Top 0.254: JP1.20 98.53,72.92 98.53,59.21 97.61,58.29 91.67,58.29 89.15,55.78 74.98,55.78 73.84,54.63 U2.9
D0  (via drill 0.61)
  Top 0.254: v34.06,19.89 30.18,16 27.89,16 26.06,14.17 26.06,12.8 IC2.2 25.83,12.57 25.83,11.43 v25.38,10.97 | v46.18,20.8 46.18,22.63 IC3.18 | v63.78,50.29 65.38,48.69 65.38,46.41 IC11.13 | U2.33 75.44,57.15 74.07,55.78 73.15,55.78 70.87,53.49 v70.87,51.66 | v22.86,13.26 22.86,13.95 21.26,15.54 v21.26,21.26 | v18.97,62.64 19.43,62.64 19.89,62.18 26.98,62.18 v29.72,59.44
  Bottom 0.254: v34.06,19.89 45.26,19.89 v46.18,20.8 | 60.81,50.29 59.21,50.29 58.52,50.98 48.01,50.98 44.12,47.09 42.06,47.09 IC9.11 41.83,47.09 40.23,48.69 40.23,55.09 40.92,55.78 42.75,55.78 43.66,56.69 43.66,57.61 42.98,58.29 35.66,58.29 U1.33 35.43,58.52 31.32,58.52 30.4,59.44 v29.72,59.44 | 60.81,50.29 v63.78,50.29 | v70.87,51.66 70.41,51.66 66.29,47.55 61.27,47.55 60.81,48.01 60.81,50.29 | v25.38,10.97 23.09,13.26 v22.86,13.26 | v21.26,21.26 12.34,30.18 12.34,36.35 16.23,40.23 16.69,40.23 18.06,41.6 18.06,61.72 v18.97,62.64
D1  (via drill 0.61)
  Top 0.254: v41.83,15.54 37.03,15.54 | 37.03,15.54 28.12,15.54 27.43,14.86 27.43,12.8 IC2.3 | v47.55,20.8 47.55,22.63 IC3.17 | v83.21,54.63 88.7,54.63 U2.32 | v63.78,67.21 63.78,62.64 59.66,58.52 54.86,58.52 53.95,59.44 48.92,59.44 47.55,58.06 45.03,58.06 42.98,56.01 35.66,56.01 U1.32 | 37.03,15.54 37.03,22.63 37.49,23.09 41.15,23.09 44.81,19.43 50.29,19.43 v50.52,19.66 | v55.55,15.54 v51.21,15.54 | v60.58,16.46 61.49,16.46 64.01,18.97 v68.12,18.97 | v79.55,31.32 84.12,31.32 88.47,35.66 v90.07,35.66
  Bottom 0.254: v41.83,15.54 46.18,19.89 46.63,19.89 v47.55,20.8 | U1.32 36.8,54.63 36.8,51.44 40.23,48.01 40.23,46.18 41.83,44.58 IC9.12 | v83.21,54.63 83.21,55.32 75.44,63.09 75.44,67.21 74.07,68.58 71.55,68.58 70.18,69.95 66.52,69.95 v63.78,67.21 | v50.52,19.66 50.52,17.6 50.29,17.37 50.29,16.46 v51.21,15.54 | v55.55,15.54 59.66,15.54 v60.58,16.46 | v68.12,18.97 79.55,30.4 v79.55,31.32 | v90.07,35.66 90.07,38.18 90.98,39.09 90.98,52.35 88.92,54.41 U2.32
D2  (via drill 0.61)
  Top 0.254: v28.57,14.63 IC2.4 | v32,20.34 v28.57,16.92 | v44.81,20.8 45.72,19.89 48.01,19.89 48.69,20.57 48.69,21.03 | 48.69,21.03 48.69,22.63 IC3.16 | v31.55,53.03 35.2,53.03 35.43,53.26 U1.31 | v79.55,51.44 83.44,51.44 83.9,51.89 88.7,51.89 U2.31 | IC9.13 42.06,41.83 43.66,40.23 43.66,38.86 42.75,37.95 v42.75,36.58 42.52,36.35 42.52,33.6 43.43,32.69 49.38,32.69 52.58,29.49 52.58,27.2 54.41,25.38 56.01,25.38 57.38,24 v57.38,23.32 | v53.03,21.03 48.69,21.03
  Bottom 0.254: v28.57,16.92 v28.57,14.63 | v32,20.34 33.15,20.34 33.6,20.8 v44.81,20.8 | v31.55,53.03 32,52.58 32,47.55 34.98,44.58 35.89,44.58 38.41,42.06 41.83,42.06 IC9.13 | v79.55,51.44 79.55,45.26 80.01,44.81 80.01,33.83 74.07,27.89 64.47,27.89 63.78,27.2 56.69,27.2 48.92,34.98 45.03,34.98 43.43,36.58 v42.75,36.58 | v53.03,21.03 55.09,21.03 v57.38,23.32
D3  (via drill 0.61)  (2 unrouted)
  Top 0.254: v82.3,53.26 72.92,53.26 v72.01,52.35
  Bottom 0.254: 59.89,46.86 59.89,47.78 58.98,48.69 58.98,49.84 58.29,50.52 50.06,50.52 42.98,43.43 40.69,43.43 39.78,44.35 39.78,47.78 36.8,50.75 35.66,50.75 U1.30 | 59.89,46.86 59.89,41.83 57.61,39.55 57.15,39.55 IC9.15 | v82.3,53.26 85.95,49.61 88.7,49.61 U2.30 | v72.01,52.35 72.01,51.44 69.49,48.92 68.35,48.92 66.29,46.86 59.89,46.86
D4  (via drill 0.61)  (1 unrouted)
  Top 0.254: IC3.14 51.44,23.77 v50.52,24.69 | v64.24,24.69 64.24,28.8 67.89,32.46 v67.89,33.6 | v66.06,35.2 66.06,36.12 66.52,36.58 66.52,37.49 65.38,38.63 60.35,38.63 v59.44,39.55 57.15,41.83 IC9.16 | v78.18,47.78 78.87,47.09 88.7,47.09 U2.29
  Bottom 0.254: v64.24,24.69 v50.52,24.69 | v67.89,33.6 66.29,35.2 v66.06,35.2 | U1.29 35.66,48.23 38.63,48.23 39.32,47.55 39.32,44.12 40.46,42.98 55.55,42.98 56.46,42.06 57.15,42.06 IC9.16 | v78.18,47.78 77.27,48.69 74.52,48.69 74.07,48.23 71.32,48.23 69.27,46.18 64.01,46.18 61.04,43.2 61.04,41.15 v59.44,39.55
D5  (via drill 0.61)  (1 unrouted)
  Top 0.254: v49.84,26.75 52.58,24 52.58,22.86 IC3.13 | v40.23,40.46 v40.23,36.35 | v54.86,42.06 57.15,44.35 IC9.17 | v79.1,44.35 88.7,44.35 U2.28 | v65.61,37.03 64.47,38.18 56.24,38.18 54.86,39.55 v54.86,42.06 | U1.28 36.58,45.72 36.8,45.49 51.44,45.49 v54.86,42.06
  Bottom 0.254: v49.84,26.75 42.75,33.83 41.15,33.83 40.23,34.75 v40.23,36.35 | v40.23,40.46 43.43,40.46 45.03,42.06 v54.86,42.06 | v79.1,44.35 79.1,40.46 74.3,35.66 69.95,35.66 68.58,37.03 v65.61,37.03
D6  (via drill 0.61)
  Top 0.254: 33.83,13.49 33.83,12.8 IC2.8 33.83,13.49 | 33.83,13.49 34.52,14.17 v41.83,14.17 | v43.66,16 45.26,16 48.01,18.75 52.12,18.75 53.95,20.57 53.95,22.63 IC3.12 | 34.29,44.35 34.29,46.18 34.98,46.86 36.12,46.86 37.03,45.95 42.98,45.95 43.89,46.86 57.15,46.86 IC9.18 | 34.29,44.35 35.43,43.2 U1.27 35.66,43.2 35.89,43.43 44.81,43.43 51.21,37.03 v64.24,37.03 | v77.72,41.83 88.7,41.83 U2.27 | 33.83,13.49 32.69,14.63 v31.77,14.63 | v16.46,37.95 v16.46,27.43 | v25.38,41.83 27.89,44.35 34.29,44.35
  Bottom 0.254: v43.66,16 v41.83,14.17 | v77.72,41.83 74.07,38.18 65.38,38.18 v64.24,37.03 | v31.77,14.63 31.77,15.09 28.8,18.06 25.83,18.06 v16.46,27.43 | v16.46,37.95 16.46,38.41 19.89,41.83 v25.38,41.83
D7  (via drill 0.61)  (2 unrouted)
  Top 0.254: v45.26,40.92 43.2,42.98 37.95,42.98 35.66,40.69 U1.26 | v87.33,40.92 88.7,39.55 U2.26 | v52.35,64.24 50.98,64.24 v47.55,60.81 | v47.78,55.32 v45.95,57.15 | v48.46,53.49 50.52,53.49 v54.41,49.61
  Bottom 0.254: v45.26,40.92 58.29,40.92 59.44,42.06 59.44,47.09 57.15,49.38 IC9.19 57.15,49.61 v54.41,49.61 | v87.33,40.92 87.33,46.86 76.12,58.06 76.12,61.49 74.98,62.64 74.98,65.15 74.07,66.06 73.15,66.06 70.41,68.81 70.41,69.04 69.95,69.49 67.44,69.49 62.87,64.92 59.44,64.92 58.29,63.78 52.81,63.78 v52.35,64.24 | v47.55,60.81 45.95,59.21 v45.95,57.15 | v47.78,55.32 47.78,54.18 v48.46,53.49
G259N
  Top 0.254: IC5.7 66.75,14.86 66.75,16.23 69.27,18.75 69.27,23.32 69.04,23.55 69.04,36.35 71.32,38.63 71.32,41.15 67.67,44.81 64.92,44.81 64.24,45.49 64.24,46.18 IC11.14
GND  (via drill 0.61)  (4 unrouted)
  Top 0.254: v37.26,11.89 37.03,11.89 36.35,12.57 IC2.10 | v48.69,16 50.06,14.63 53.95,14.63 55.09,13.49 55.09,12.8 IC3.10 | v48.69,17.83 49.15,18.29 52.58,18.29 56.01,21.72 56.01,24 55.78,24.23 54.18,24.23 50.98,27.43 50.98,28.57 IC1.7 | v35.89,2.97 39.78,2.97 41.83,5.03 JP2.17 42.06,5.03 44.58,2.52 80.01,2.52 82.53,5.03 JP2.49 82.53,5.26 82.53,7.54 JP2.50 | 90.07,10.29 90.75,9.6 94.64,9.6 95.78,10.74 95.78,11.43 IC4.10 | 90.07,10.29 89.61,10.74 89.61,11.43 IC4.5 | v89.38,9.6 90.07,10.29 | v67.89,36.12 70.41,38.63 70.41,40.01 IC11.8 | v69.72,16.46 68.12,14.86 IC5.8 | v77.5,16.46 79.55,16.46 80.47,15.54 | 80.47,15.54 80.47,14.86 IC6.8 80.47,15.54 | v62.41,23.55 62.41,28.57 IC12.7 62.41,28.8 v62.41,30.86 | JP2.29 57.15,5.94 58.52,7.32 58.52,8 60.35,9.83 v66.98,9.83 | v84.58,16.69 81.61,16.69 80.47,15.54
  Bottom 0.254: v37.26,11.89 37.26,8.91 38.18,8 38.18,7.09 39.09,6.17 40.69,6.17 | 40.69,6.17 40.92,6.17 41.83,5.26 JP2.17 | 40.69,6.17 40.69,8 v48.69,16 v48.69,17.83 | v35.89,2.97 35.43,2.52 26.75,2.52 24.23,5.03 JP2.3 | 90.07,16.69 90.07,18.06 96.47,24.46 96.47,26.52 JP1.1 | 90.07,16.69 93.04,13.72 93.04,12.8 89.61,9.37 | 89.61,9.37 88.01,7.77 82.75,7.77 JP2.50 | 89.61,9.37 v89.38,9.6 | 62.41,36.12 45.26,36.12 42.06,39.32 IC9.14 | 62.41,36.12 v67.89,36.12 | v77.5,16.46 v69.72,16.46 69.27,16.46 | v62.41,23.55 67.21,18.75 67.21,18.52 69.27,16.46 | v66.98,9.83 66.98,14.17 69.27,16.46 | v62.41,30.86 62.41,36.12 | v84.58,16.69 90.07,16.69
IOSELN  (via drill 0.61)
  Top 0.254: IC4.19 85.72,20.8 83.9,18.97 73.38,18.97 70.64,16.23 70.64,15.54 66.98,11.89 65.15,11.89 64.24,12.8 64.24,14.63 IC5.5 64.24,14.86 64.47,15.09 v64.47,16.69 | v45.95,3.89 47.55,3.89 48.23,4.57 48.23,5.49 49.15,6.4 52.58,6.4 53.26,7.09 v53.26,8.69 | v57.38,14.17 57.38,14.86 61.27,18.75 v62.41,18.75
  Bottom 0.254: v45.95,3.89 38.86,3.89 38.18,4.57 38.18,5.49 37.49,6.17 33.83,6.17 32.92,5.26 31.77,5.26 JP2.9 | v53.26,8.69 53.26,10.06 v57.38,14.17 | v64.47,16.69 v62.41,18.75
IRQN  (via drill 0.61)
  Top 0.254: v25.15,2.52 29.49,2.52 30.86,1.14 87.55,1.14 96.7,10.29 96.7,22.63 94.64,24.69 90.75,24.69 88.92,26.52 U2.21
  Bottom 0.254: U1.4 20.34,68.58 21.49,67.44 36.12,67.44 37.03,68.35 46.86,68.35 51.89,63.32 58.29,63.32 59.21,62.41 59.66,62.41 R2.1 59.89,62.18 61.27,62.18 67.67,55.78 77.27,55.78 83.21,49.84 83.21,32.23 88.7,26.75 U2.21 | v25.15,2.52 22.86,4.8 22.86,5.49 23.55,6.17 27.2,6.17 28.12,5.26 29.03,5.26 JP2.7
N$1
  Top 0.254: R1.1 59.66,65.84 37.03,65.84 35.89,64.69 21.49,64.69 20.34,63.55 U1.6
N$4  (1 unrouted)
N$5  (1 unrouted)
N$6  (1 unrouted)
N$7  (1 unrouted)
N$8  (1 unrouted)
N$9  (1 unrouted)
N$10  (1 unrouted)
N$11  (1 unrouted)
N$12
  Top 0.254: IC4.7 92.13,11.43 92.13,10.74 92.81,10.06 93.95,10.06 94.41,10.52 94.41,11.43 IC4.9 94.41,11.66 94.41,19.66 93.95,20.12 | 92.58,20.34 92.81,20.12 93.95,20.12 | 92.58,20.34 92.13,20.8 92.13,21.49 IC4.14 | 93.95,20.12 94.41,20.57 94.41,21.49 IC4.12 | 89.15,19.2 89.38,19.43 89.38,21.49 IC4.16 89.38,21.72 89.38,22.4 88.7,23.09 87.78,23.09 87.1,22.4 | 89.15,19.2 87.1,17.14 87.1,11.66 IC4.3 | 87.1,22.4 87.1,21.72 IC4.18 87.1,22.4 | 87.1,22.4 85.27,24.23 84.12,24.23 83.67,23.77 83.67,21.95 81.15,19.43 71.32,19.43 69.95,20.8 69.95,23.32 69.49,23.77 69.49,33.38 71.78,35.66 71.78,46.86 68.81,49.84 68.81,64.92 62.64,71.09 61.04,71.09 R6.1 | 92.58,20.34 90.98,18.75 89.61,18.75 89.15,19.2
PH2  (via drill 0.61)  (1 unrouted)
  Top 0.254: U1.37 24.69,68.58 20.8,64.69 19.66,64.69 18.06,63.09 18.06,47.55 14.63,44.12 14.63,13.03 21.49,6.17 21.49,5.26 JP2.1 | v76.12,71.55 74.07,73.61 72.69,73.61 69.72,76.58 69.72,77.95 69.04,78.64 61.04,78.64 v57.84,75.44
  Bottom 0.254: v76.12,71.55 81.84,65.84 81.84,59.89 88.47,53.26 89.38,53.26 90.53,52.12 90.53,39.32 88.92,37.72 88.92,37.03 U2.25 | v57.84,75.44 49.61,75.44 42.98,68.81 35.89,68.81 35.66,68.58 U1.37
PH2N
  Top 0.254: IC2.11 36.35,22.86 37.95,24.46 41.83,24.46 44.35,26.98 44.35,28.57 IC1.2
RAMOEN  (2 unrouted)
RASN
  Top 0.254: IC6.5 76.81,14.86 76.81,15.32 75.89,16.23 71.32,16.23 71.09,16 71.09,15.32 66.06,10.29 56.92,10.29 56.24,9.6 49.84,9.6 48.23,8 48.23,6.4 47.09,5.26 JP2.21
RDY  (1 unrouted)
  Bottom 0.254: R3.1 58.29,77.27 56.01,77.27 55.09,76.35 37.03,76.35 35.89,77.5 24,77.5 20.34,73.84 U1.2
RESN  (via drill 0.61)  (1 unrouted)
  Top 0.254: IC11.15 62.87,57.38 65.38,59.89 65.38,61.04 | 65.38,61.04 65.38,66.98 63.55,68.81 47.78,68.81 40.46,76.12 35.66,76.12 U1.40 | v75.21,59.89 88.7,59.89 U2.34 | 65.38,61.04 v66.52,61.04
  Bottom 0.254: v75.21,59.89 74.07,61.04 v66.52,61.04
ROMN
  Top 0.254: IC12.2 56.01,28.8 56.01,29.49 58.29,31.77 66.52,31.77 66.98,32.23 66.98,37.95 65.61,39.32 65.61,40.01 IC11.4 65.38,40.23 65.38,42.06 64.69,42.75 62.41,42.75 60.12,45.03 60.12,48.92 57.15,51.89 IC9.20
  Bottom 0.254: IC9.22 55.32,55.32 55.32,53.95 57.15,52.12 IC9.20
ROW0
  Top 0.254: JP1.12 96.47,54.41 90.3,54.41 89.15,53.26 84.58,53.26 83.21,51.89 80.47,51.89 80.01,52.35 74.07,52.35 73.84,52.12 U2.10
ROW1
  Top 0.254: JP1.11 96.47,51.89 90.53,51.89 89.38,50.75 80.24,50.75 79.1,49.61 73.84,49.61 U2.11
ROW2
  Top 0.254: JP1.10 96.47,49.38 93.04,49.38 89.38,45.72 88.24,45.72 87.33,44.81 80.01,44.81 77.95,46.86 73.84,46.86 U2.12
RW  (via drill 0.61)  (2 unrouted)
  Top 0.254: v43.66,14.63 43.66,12.8 IC3.1 | v25.38,9.37 v40.23,9.37 | v66.06,32.69 58.06,32.69 54.63,29.26 54.63,28.8 IC12.1 | v71.09,32.69 73.38,30.4 87.55,30.4 88.7,29.26 U2.22 88.92,29.03 92.35,25.6 v93.04,25.6 | v29.72,58.06 32.46,60.81 35.43,60.81 U1.34 | v78.64,11.66 78.64,7.09 77.95,6.4 77.04,6.4 76.35,5.71 76.35,4.8 75.44,3.89 56.69,3.89 55.55,5.03 54.63,5.03 JP2.27
  Bottom 0.254: v43.66,14.63 43.66,14.17 40.23,10.74 v40.23,9.37 | v25.38,9.37 24.23,9.37 22.86,8 22.86,7.32 21.72,6.17 21.03,6.17 20.34,5.49 20.34,4.57 23.77,1.14 50.52,1.14 54.41,5.03 JP2.27 | v71.09,32.69 v66.06,32.69 63.32,29.95 61.95,29.95 56.46,35.43 45.26,35.43 43.2,37.49 41.6,37.49 37.26,41.83 34.98,41.83 32.92,39.78 30.18,39.78 28.57,41.38 28.57,51.21 29.72,52.35 v29.72,58.06 | v78.64,11.66 78.64,13.49 87.78,22.63 91.44,22.63 93.04,24.23 v93.04,25.6
VCC  (via drill 0.61)  (2 unrouted)
  Top 0.254: v24.69,16.23 24.69,22.63 IC2.20 24.92,22.86 24.92,23.55 27.2,25.83 33.6,25.83 34.06,26.29 40.46,26.29 v41.38,25.38 | v42.75,23.77 43.66,22.86 IC3.20 | 53.95,34.29 54.41,34.75 IC12.14 | 53.95,34.29 53.03,33.38 43.89,33.38 43.2,34.06 43.2,34.75 IC1.14 | v68.35,22.63 63.32,22.63 | 63.32,22.63 60.12,22.63 59.21,21.72 59.21,21.03 IC5.16 | IC6.16 71.55,21.03 70.87,21.72 v70.87,23.09 70.87,31.55 70.18,32.23 70.18,33.15 72.69,35.66 74.3,35.66 77.95,39.32 | v56.01,32.23 53.95,34.29 | 63.32,22.63 v63.32,28.12 | v84.58,23.32 84.58,21.72 IC4.20 | 57.15,72.47 54.63,74.98 54.63,77.27 R4.2 54.41,77.5 53.26,78.64 19.2,78.64 12.8,72.24 12.8,35.2 13.95,34.06 13.95,11.43 R5.2 | v61.72,48.46 61.72,46.41 IC11.16 | 68.58,74.07 R6.2 68.58,67.21 69.72,66.06 R1.2 69.95,65.84 69.95,62.41 R2.2 69.72,62.18 v69.72,52.35 69.72,51.44 72.24,48.92 72.24,44.12 73.15,43.2 74.07,43.2 77.95,39.32 | 68.58,74.07 R3.2 | 57.15,72.47 65.61,72.47 67.21,74.07 68.58,74.07 | 57.15,72.47 IC9.28 | JP1.4 93.04,34.29 89.15,38.18 79.1,38.18 77.95,39.32
  Bottom 0.254: v24.69,16.23 22.63,14.17 22.4,14.17 21.72,13.49 21.72,11.43 | 21.72,11.43 21.72,7.77 JP2.2 | v42.75,23.77 41.38,25.15 v41.38,25.38 | 21.72,11.43 R5.2 | v68.35,22.63 70.41,22.63 v70.87,23.09 | v56.01,32.23 60.12,28.12 v63.32,28.12 | v84.58,23.32 87.1,23.32 87.55,23.77 89.84,23.77 94.64,28.57 94.64,32.46 96.47,34.29 JP1.4 | v61.72,48.46 65.84,48.46 v69.72,52.35
VD0  (2 unrouted)
VD1  (2 unrouted)
VD2  (2 unrouted)
VD3  (2 unrouted)
VD4  (2 unrouted)
VD5  (2 unrouted)
VD6  (2 unrouted)
VD7  (2 unrouted)
VDD
  Bottom 0.254: U2.20 73.61,26.75 56.46,26.75 48.69,34.52 44.81,34.52 43.66,35.66 42.29,35.66 38.63,39.32 29.95,39.32 28.12,41.15 28.12,54.18 24,58.29 20.34,58.29 U1.8